# EAGLE design PS_cubesat_baterias (EAGLE 9.0.0)
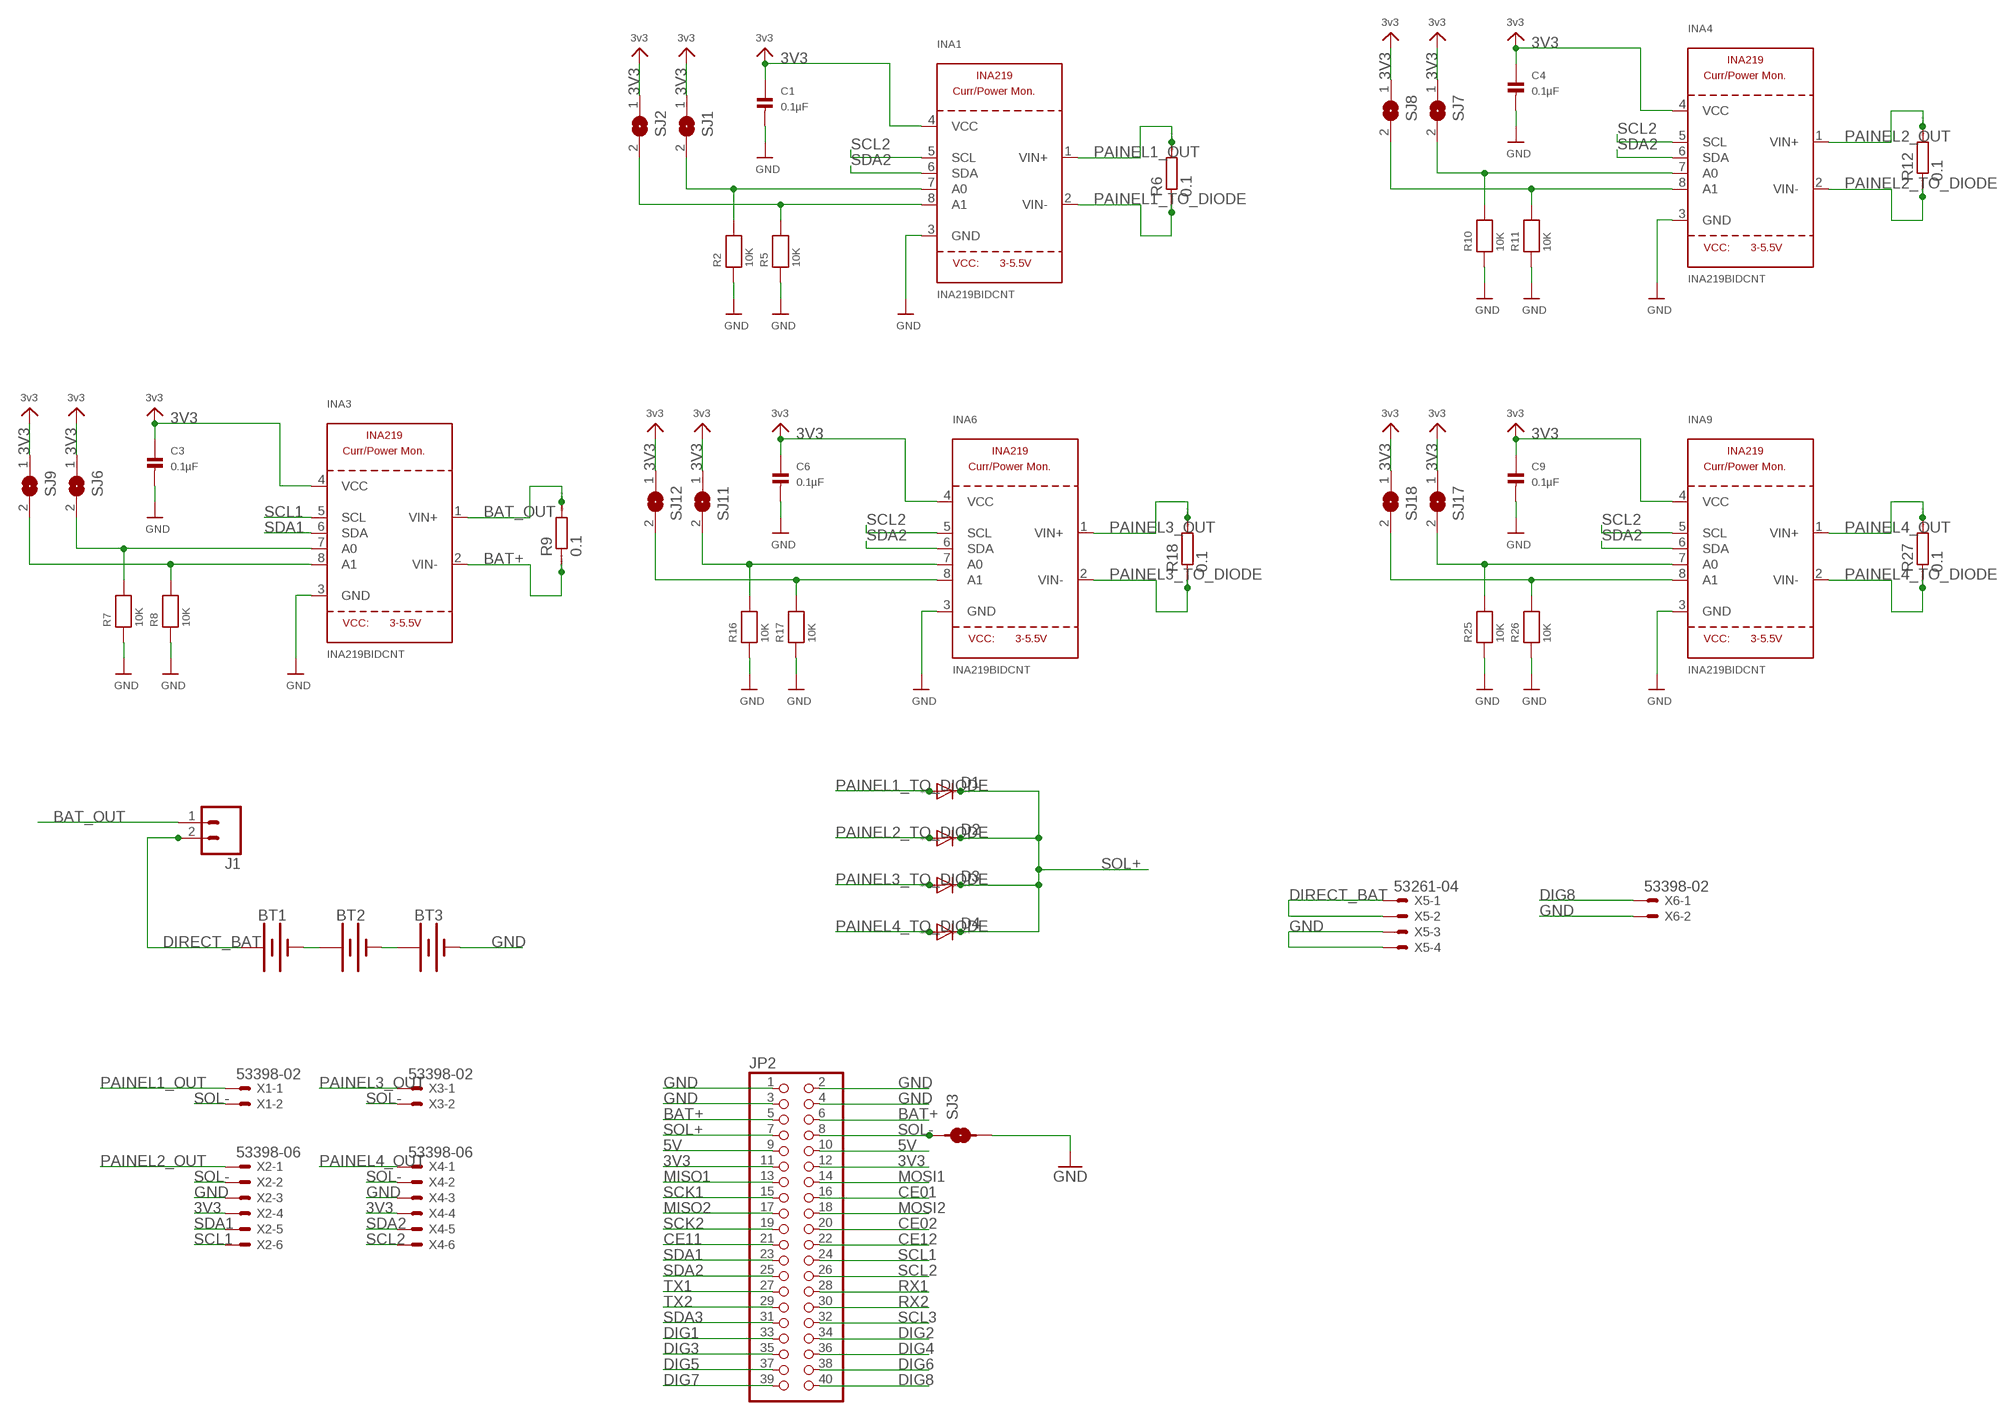
[diagram p0: schematic, sheet 1]

## Parts
BT1  BATTERY-18650  [BATTERY_18650-HOLDER]
BT2  BATTERY-18650  [BATTERY_18650-HOLDER]
BT3  BATTERY-18650  [BATTERY_18650-HOLDER]
C1  0.1µF  CAP_CERAMIC1206  [1206]
C3  0.1µF  CAP_CERAMIC1206  [1206]
C4  0.1µF  CAP_CERAMIC1206  [1206]
C6  0.1µF  CAP_CERAMIC1206  [1206]
C9  0.1µF  CAP_CERAMIC1206  [1206]
D1  DIODE-DO-214AC  [DO-214AC]
D2  DIODE-DO-214AC  [DO-214AC]
D3  DIODE-DO-214AC  [DO-214AC]
D4  DIODE-DO-214AC  [DO-214AC]
INA1  INA219BIDCNT  INA219  [SOT23-8]
INA3  INA219BIDCNT  INA219  [SOT23-8]
INA4  INA219BIDCNT  INA219  [SOT23-8]
INA6  INA219BIDCNT  INA219  [SOT23-8]
INA9  INA219BIDCNT  INA219  [SOT23-8]
J1  M02JST-PTH-VERT  [JST-2-PTH-VERT]
JP2  PINHD-2X20  [2X20]
R2  10K  RESISTOR1206  [1206]
R5  10K  RESISTOR1206  [1206]
R6  0.1  RR2512  [R2512]
R7  10K  RESISTOR1206  [1206]
R8  10K  RESISTOR1206  [1206]
R9  0.1  RR2512  [R2512]
R10  10K  RESISTOR1206  [1206]
R11  10K  RESISTOR1206  [1206]
R12  0.1  RR2512  [R2512]
R16  10K  RESISTOR1206  [1206]
R17  10K  RESISTOR1206  [1206]
R18  0.1  RR2512  [R2512]
R25  10K  RESISTOR1206  [1206]
R26  10K  RESISTOR1206  [1206]
R27  0.1  RR2512  [R2512]
SJ1  SOLDERJUMPERREFLOW_NOPASTE  [SOLDERJUMPER_REFLOW_NOPASTE]
SJ2  SOLDERJUMPERREFLOW_NOPASTE  [SOLDERJUMPER_REFLOW_NOPASTE]
SJ3  SMD-JUMPER-2  [SMD-JUMPER-2]
SJ6  SOLDERJUMPERREFLOW_NOPASTE  [SOLDERJUMPER_REFLOW_NOPASTE]
SJ7  SOLDERJUMPERREFLOW_NOPASTE  [SOLDERJUMPER_REFLOW_NOPASTE]
SJ8  SOLDERJUMPERREFLOW_NOPASTE  [SOLDERJUMPER_REFLOW_NOPASTE]
SJ9  SOLDERJUMPERREFLOW_NOPASTE  [SOLDERJUMPER_REFLOW_NOPASTE]
SJ11  SOLDERJUMPERREFLOW_NOPASTE  [SOLDERJUMPER_REFLOW_NOPASTE]
SJ12  SOLDERJUMPERREFLOW_NOPASTE  [SOLDERJUMPER_REFLOW_NOPASTE]
SJ17  SOLDERJUMPERREFLOW_NOPASTE  [SOLDERJUMPER_REFLOW_NOPASTE]
SJ18  SOLDERJUMPERREFLOW_NOPASTE  [SOLDERJUMPER_REFLOW_NOPASTE]
X1  53398-02  [53398-02]
X2  53398-06  [53398-06]
X3  53398-02  [53398-02]
X4  53398-06  [53398-06]
X5  53261-04  [53261-04]
X6  53398-02  [53398-02]

## Nets
3V3: C1.1 C3.1 C4.1 C6.1 C9.1 INA1.4(VCC) INA3.4(VCC) INA4.4(VCC) INA6.4(VCC) INA9.4(VCC) JP2.11 JP2.12 SJ1.1 SJ2.1 SJ6.1 SJ7.1 SJ8.1 SJ9.1 SJ11.1 SJ12.1 SJ17.1 SJ18.1 X2.4 X4.4 ; supply symbol labelled 3v3
5V: JP2.9 JP2.10
BAT+: INA3.2(VIN-) JP2.5 JP2.6 R9.1
BAT_OUT: INA3.1(VIN+) J1.1 R9.2
CE01: JP2.16
CE02: JP2.20
CE11: JP2.21
CE12: JP2.22
DIG1: JP2.33
DIG2: JP2.34
DIG3: JP2.35
DIG4: JP2.36
DIG5: JP2.37
DIG6: JP2.38
DIG7: JP2.39
DIG8: JP2.40 X6.1
DIRECT_BAT: BT1.PWR@1(+) J1.2 X5.1 X5.2
GND: BT3.GND@1(-) C1.2 C3.2 C4.2 C6.2 C9.2 INA1.3(GND) INA3.3(GND) INA4.3(GND) INA6.3(GND) INA9.3(GND) JP2.1 JP2.2 JP2.3 JP2.4 R2.1 R5.1 R7.1 R8.1 R10.1 R11.1 R16.1 R17.1 R25.1 R26.1 SJ3.2 X2.3 X4.3 X5.3 X5.4 X6.2
MISO1: JP2.13
MISO2: JP2.17
MOSI1: JP2.14
MOSI2: JP2.18
N$2: BT1.GND@1(-) BT2.PWR@1(+)
N$3: BT2.GND@1(-) BT3.PWR@1(+)
N$6: INA1.8(A1) R5.2 SJ2.2
N$7: INA1.7(A0) R2.2 SJ1.2
N$8: INA3.8(A1) R8.2 SJ9.2
N$9: INA3.7(A0) R7.2 SJ6.2
N$10: INA4.8(A1) R11.2 SJ8.2
N$11: INA4.7(A0) R10.2 SJ7.2
N$14: INA6.8(A1) R17.2 SJ12.2
N$15: INA6.7(A0) R16.2 SJ11.2
N$20: INA9.8(A1) R26.2 SJ18.2
N$21: INA9.7(A0) R25.2 SJ17.2
PAINEL1_OUT: INA1.1(VIN+) R6.2 X1.1
PAINEL1_TO_DIODE: D1.A INA1.2(VIN-) R6.1
PAINEL2_OUT: INA4.1(VIN+) R12.2 X2.1
PAINEL2_TO_DIODE: D2.A INA4.2(VIN-) R12.1
PAINEL3_OUT: INA6.1(VIN+) R18.2 X3.1
PAINEL3_TO_DIODE: D3.A INA6.2(VIN-) R18.1
PAINEL4_OUT: INA9.1(VIN+) R27.2 X4.1
PAINEL4_TO_DIODE: D4.A INA9.2(VIN-) R27.1
RX1: JP2.28
RX2: JP2.30
SCK1: JP2.15
SCK2: JP2.19
SCL1: INA3.5(SCL) JP2.24 X2.6
SCL2: INA1.5(SCL) INA4.5(SCL) INA6.5(SCL) INA9.5(SCL) JP2.26 X4.6
SCL3: JP2.32
SDA1: INA3.6(SDA) JP2.23 X2.5
SDA2: INA1.6(SDA) INA4.6(SDA) INA6.6(SDA) INA9.6(SDA) JP2.25 X4.5
SDA3: JP2.31
SOL+: D1.C D2.C D3.C D4.C JP2.7
SOL-: JP2.8 SJ3.1 X1.2 X2.2 X3.2 X4.2
TX1: JP2.27
TX2: JP2.29

## Library data of the parts
BT1-BT3 = SparkFun-Batteries:BATTERY: Battery - Single Cell A variety of battery chemistries, sizes, and footprints. Device List: 20MM_PTH - Coin Cell Battery Holder - 20mm (PTH) <https://www.sparkfun.com/products/783> 6.8MM_PTH - Coin Cell Battery Holder - 6.8MM(SMD) <https://www.digikey.com/product-detail/en/seiko-instruments/MS621FE-FL11E/728-1057-ND/1889208?WT.srch=1&gclid=CNOQ5a6LzdQCFZS2wAodXCkE0g> 12MM_SMD - Coin Cell Battery Holder - 12mm (SMD) <https://www.sparkfun.com/products/10592> 12MM_PTH - Coin Cell Battery Holder - 12mm (PTH) <https://www.sparkfun.com/products/7948> 20MM_SMD - 20mm Coin Cell Battery Holder (SMD) (2 legs) Used on the Big Time Watch Kit <https://www.sparkfun.com/products/11734> 20MM_SMD_4LEGS - Coin Cell Battery Holder - 20mm (SMD) <https://www.sparkfun.com/products/11892> 20MM_SMD_4LEGS_OVERPASTE - Coin Cell Battery Holder - 20mm (SMD) <https://www.sparkfun.com/products/11892> (Over-paste on the legs) 24.5MM_PTH - Coin Cell Battery Holder - 24.5mm (PTH) <https://www.sparkfun.com/products/8863> 9V - 9V Battery Holder - PC Mount Used on the SparkFun SparkPunk Sound Kit <https://www.sparkfun.com/products/11177> and SparkFun SparkPunk Sequencer Kit <https://www.sparkfun.com/products/12707> 18650 - Battery Holder - 18650 (PTH) <https://www.sparkfun.com/products/13113> AA - Battery Holder - 1xAA (PTH) <https://www.sparkfun.com/products/7949> AAA - Battery Holder - 1xAAA (PTH) <https://www.sparkfun.com/products/12718> AA_KIT - Battery Holder - 1xAA (PTH) <https://www.sparkfun.com/products/7949> Special kit package - pads only have exposed copper on one side of the board. AAA_KIT - Battery Holder - 1xAAA (PTH) <https://www.sparkfun.com/products/12718> Special kit package - pads only have exposed copper on one side of the board.; PROD_ID: BATT-12327; SF_SKU: PRT-13113
C1 C3 C4 C6 C9 = microbuilder:CAP_CERAMIC: Ceramic Capacitors 0402 - 0402 Surface Mount Capacitors 16pF 50V 5% [Digikey: 445-4899-2-ND] 18pF 50V 5% [Digikey: 490-1281-2-ND] 22pF 50V 5% [Digikey: 490-1283-2-ND] 68pF 50V 5% [Digikey: 490-1289-2-ND] 0.1uF 10V 10% [Digikey: 490-1318-2-ND] 1.0uF 6.3V 10% [Digikey: 490-1320-2-ND] 0603 - 0603 Surface Mount Capacitors 16 pF 50V 5% [Digikey: 445-5051-2-ND] 22 pF 50V [Digikey: PCC220ACVTR-ND] 33 pF 50V 5% [Digikey: 490-1415-1-ND] 56pF 50V 5% [Digikey: 490-1421-1-ND] 220pF 50V 5% [Digikey: 445-1285-1-ND] 680 pF 50V 2200 pF 50V 5% C0G [Digikey: 445-1297-1-ND] 5600 pF 100V 5% X7R [Digikey: 478-3711-1-ND] 0.1 µF 25V 10% [Digikey: PCC2277TR-ND] 0.22 µF 16V 10% X7R [Digikey: 445-1318-1-ND] 1.0 µF 25V 10% [Digikey: 445-5146-2-ND] 0603 - RF Specific 3pF 250V +/-0.1pF RF [Digikey: 712-1347-1-ND] 18 pF 250V 5% [Digikey: 478-3505-1-ND or 712-1322-1-ND] 56 pF 250V 5% C0G RF [Digikey: 490-4867-1-ND] 68 pF 250V RF [Digikey: 490-4868-1-ND] 0805 - 0805 Surface Mount Capacitors 220 pF 250V 2% RF Ceramic Capacitor [Digikey: 712-1398-1-ND] 1000 pF 50V 2% NP0 Ceramic Capacitor [Digikey: 478-3760-1-ND] 0.1 µF 25V 10% Ceramic Capacitor [Digikey: PCC1828TR-ND] 1.0 µF 16V 10% Ceramic Capacitor[Digikey: 490-1691-2-ND] 10.0 µF 10V 10% Ceramic Capacitor[Digikey: 709-1228-1-ND] 10.0 uF 16V 10% Ceramic Capacitor [Digikey: 478-5165-2-ND] 47 uF 6.3V 20% Ceramic Capacitor [Digikey: 587-1779-1-ND or 399-5506-1-ND] 1206 - 1206 Surface Mount Capacitors 47uF 10V 20% Ceramic Capacitor [Digikey: 490-5528-1-ND or 399-5508-1-ND or 445-6010-1-ND] 100uF 6.3V -20%, +80% Y5V Ceramic Capacitor (Digikey: 490-4512-1-ND, Mouser: 81-GRM31CF50J107ZE1L)
D1-D4 = diode:DIODE-: DIODE
INA1 INA3 INA4 INA6 INA9 = microbuilder:INA219: INA219 - I2C Current/Power Monitor Voltage Range: 0-26V Accuracy: 0.5% Temperature: -40°C - 125°C
J1 = SparkFun-Connectors:M02: Standard 2-pin 0.1" header. Use with - straight break away headers ( PRT-00116) - right angle break away headers (PRT-00553) - swiss pins (PRT-00743) - machine pins (PRT-00117) - female headers (PRT-00115) Molex polarized connector foot print use with: PRT-08233 with associated crimp pins and housings. 2.54_SCREWTERM for use with PRT-10571. 3.5mm Screw Terminal footprints for PRT-08084 5mm Screw Terminal footprints for use with PRT-08432
JP2 = pinhead:PINHD-2X20: PIN HEADER
R2 R5 R7 R8 R10 R11 R16 R17 R25 R26 = microbuilder:RESISTOR: Resistors 0402 - 0402 Surface Mount Package 22 Ohm 1% 1/16W [Digikey: 311-22.0LRTR-ND] 33 Ohm 5% 1/16W 1.0K 5% 1/16W 1.5K 5% 1/16W 2.0K 1% 1/16W 10.0K 1% 1/16W [Digikey: 311-10.0KLRTR-ND] 10.0K 5% 1/16W [Digikey: RMCF0402JT10K0TR-ND] 12.1K 1% 1/16W [Digikey: 311-22.0LRTR-ND] 100.0K 5% 1/16W 0603 - 0603 Surface Mount Package 0 Ohm 1/10 Watt 1% Resistor 15 Ohm 1/10 Watt 1% Resistor 33 Ohm 1/10 Watt 1% Resistor 49.9 Ohm 1/10 Watt 1% Resistor 100 Ohm 1/10 Watt 1% Resistor 150 Ohm 1/10 Watt 1% Resistor 240 Ohm 1/10 Watt 1% Resistor 390 Ohm 1/10 Watt 1% Resistor 560 Ohm 1/10 Watt 1% Resistor 680 Ohm 1/10 Watt 1% Resistor 750 Ohm 1/10 Watt 1% Resistor 1.0K Ohm 1/10 Watt 1% Resistor 1.5K Ohm 1/10 Watt 1% Resistor 2.0K Ohm 1/10 Watt 1% Resistor 2.2K Ohm 1/10 Watt 1% Resistor 3.3K Ohm 1/10 Watt 1% Resistor 4.7K Ohm 1/10 Watt 1% Resistor 10.0K Ohm 1/10 Watt 1% Resistor 12.0K Ohm 1/10 Watt 1% Resistor 12.1K Ohm 1/10 Watt 1% Resistor 20.0K Ohm 1/10 Watt 1% Resistor 33.0K Ohm 1/10 Watt 1% Resistor 100.0K Ohm 1/10 Watt 1% Resistor 0805 - 0805 Surface Mount Package 0 Ohm 1/8 Watt 1% Resistor 33 Ohm 1/8 Watt 1% Resistor 100 Ohm 1/8 Watt 1% Resistor 150 Ohm 1/8 Watt 1% Resistor 200 Ohm 1/8 Watt 1% Resistor 240 Ohm 1/8 Watt 1% Resistor 330 Ohm 1/8 Watt 1% Resistor 390 Ohm 1/8 Watt 1% Resistor 470 Ohm 1/8 Watt 1% Resistor 1.0K Ohm 1/8 Watt 1% Resistor 1.5K Ohm 1/8 Watt 1% Resistor 2.0K Ohm 1/8 Watt 1% Resistor 4.7K Ohm 1/8 Watt 1% Resistor 5.1K Ohm 1/8 Watt 1% Resistor 5.6K Ohm 1/8 Watt 1% Resistor 10.0K Ohm 1/8 Watt 1% Resistor 22.0K Ohm 1/8 Watt 1% Resistor 33.0K Ohm 1/8 Watt 1% Resistor 100K Ohm 1/8 Watt 1% Resistor 1206 - 1206 Surface Mount Package 2012 - 2010 Surface Mount Package 0.11 Ohm 1/2 Watt 1% Resistor - Digikey: RHM.11UCT-ND
R6 R9 R12 R18 R27 = eagle-ltspice:R: RESISTOR, European symbol; SPICEMODEL: NONE; SPICEPREFIX: R
SJ1 SJ2 SJ6-SJ9 SJ11 SJ12 SJ17 SJ18 = microbuilder:SOLDERJUMPER: SMD Solder JUMPER Solder the two pads together to create a connection, or remove the solder to break it. REFLOW - Use this footprint for solder paste and reflow ovens. WAVE - Use this footprint for hand-soldering (larger pads). CLOSED - Has a trace between the two pads to ensure it is closed by default. The trace needs to be cut to disable the jumper, and can be closed again by creating a solder bridge between the two pads.
SJ3 = FaBo-etc:SMD-JUMPER-2
X1 X3 X6 = con-molex:53?-02: CONNECTOR wire to board 1.25 mm (.049 inch) pitch header; MF: MOLEX; OC_FARNELL: unknown; OC_NEWARK: unknown
X2 X4 = con-molex:53?-06: CONNECTOR wire to board 1.25 mm (.049 inch) pitch header; MF: MOLEX; OC_FARNELL: 1125368; OC_NEWARK: unknown
X5 = con-molex:53?-04: CONNECTOR wire to board 1.25 mm (.049 inch) pitch header; MF: MOLEX; OC_FARNELL: 1125374; OC_NEWARK: unknown

## Board
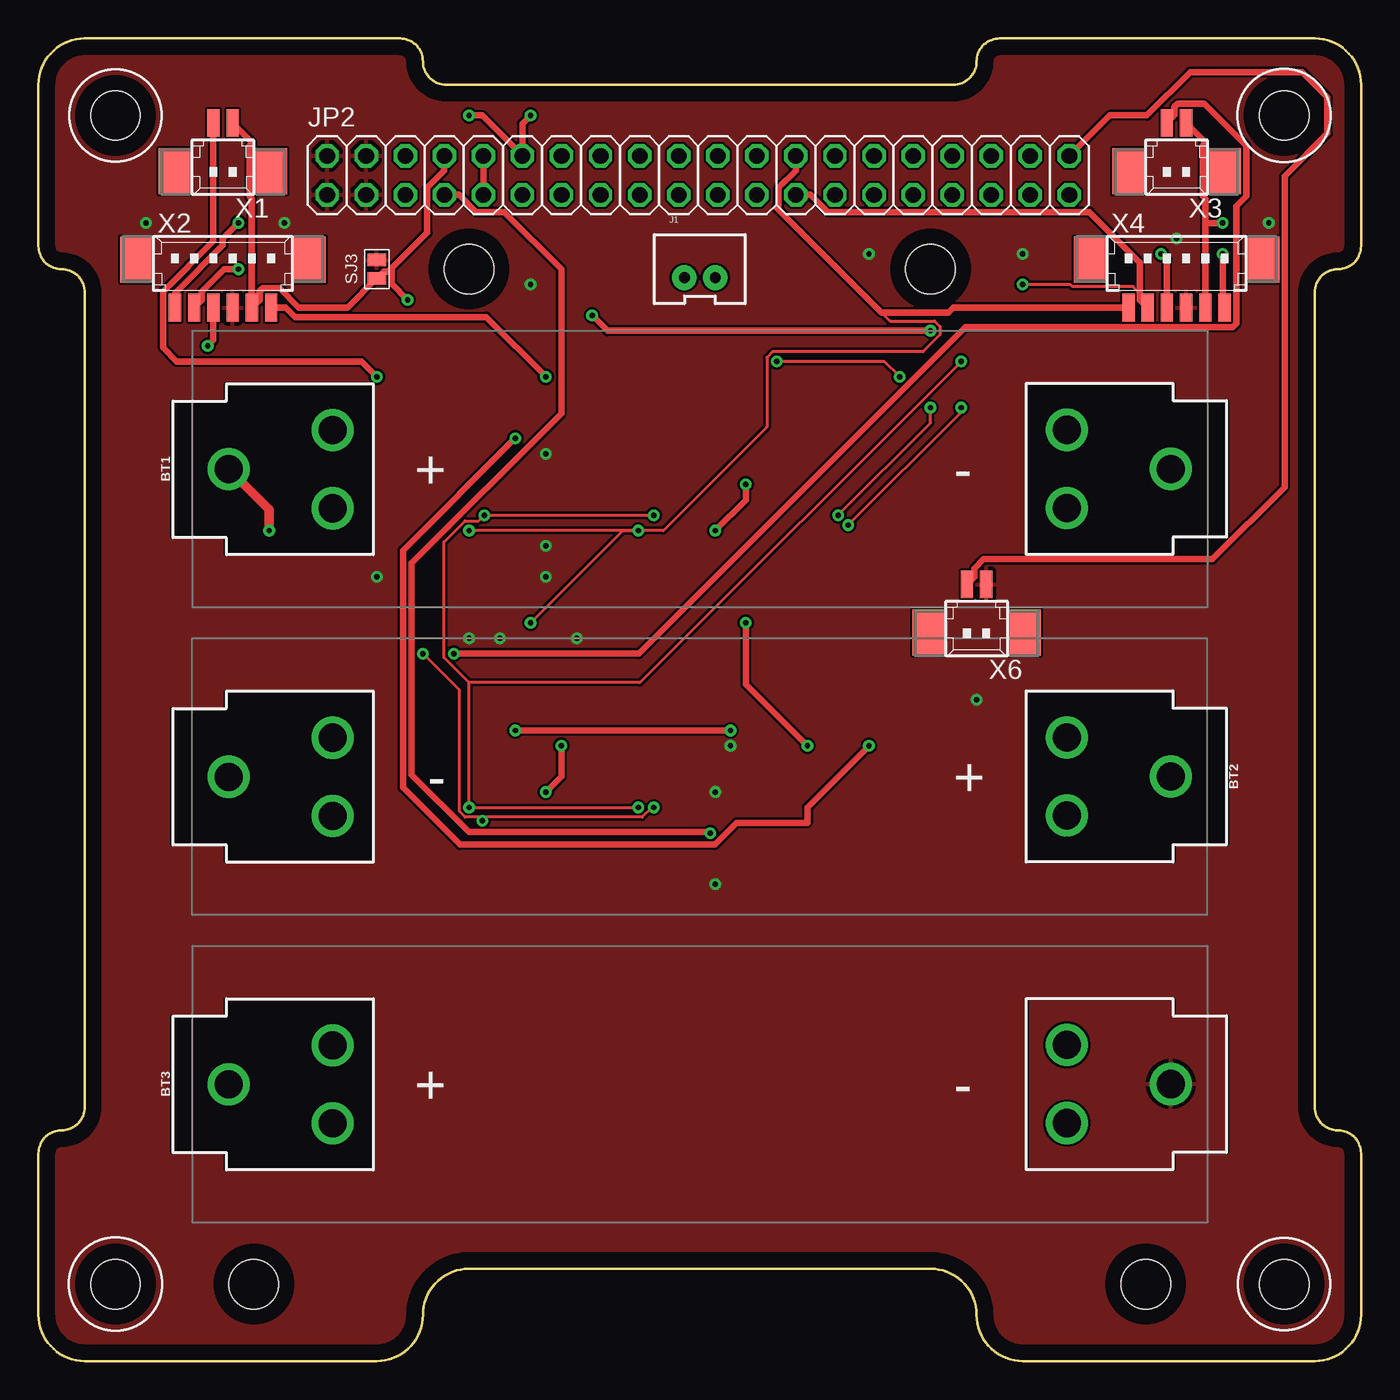
[diagram p1: board, top side]
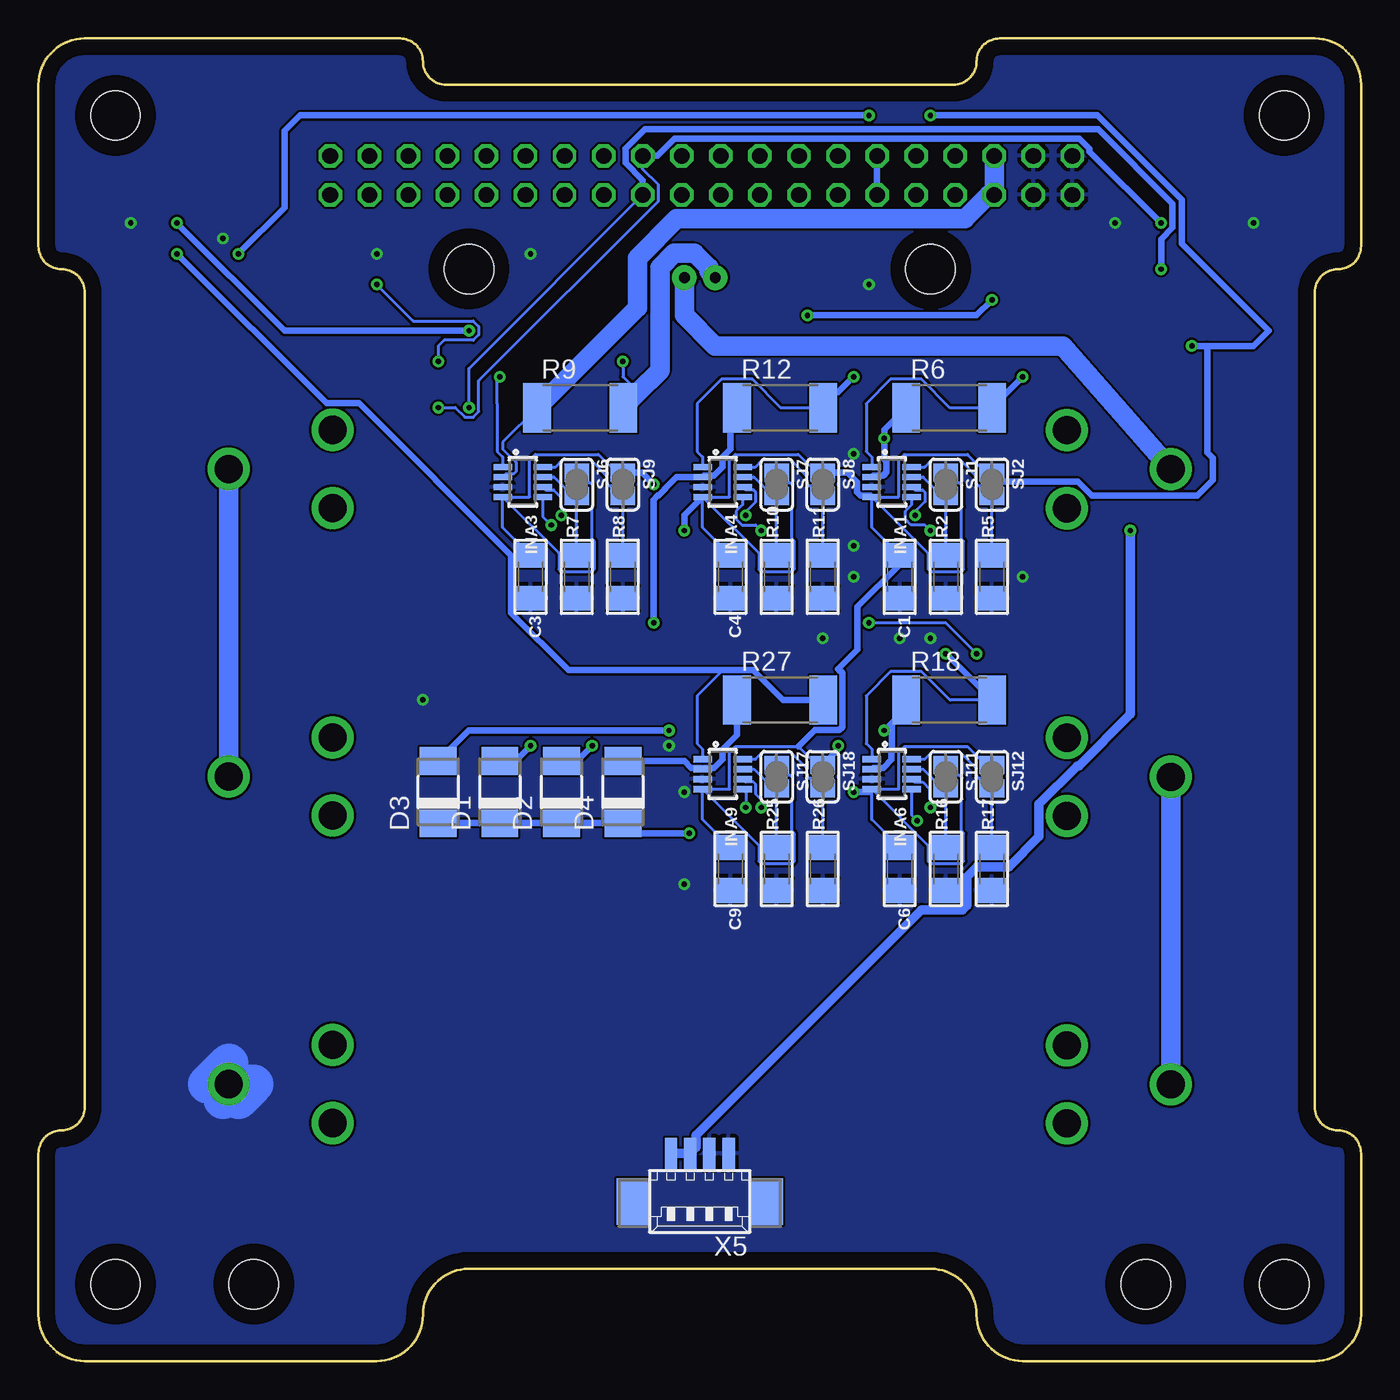
[diagram p2: board, bottom side, seen from below]

Size 86 x 86 mm. Coordinates in mm from the lower left corner, seen from the top.
Outline: 0,83 0,72.5 arc90 1.5,71 arc-90 3,69.5 3,16.5 arc-90 1.5,15 arc90 0,13.5 0,3 arc90 3,0 22,0 arc90 25,3 arc-90 28,6 58,6 arc-90 61,3 arc90 64,0 83,0 arc90 86,3 86,13.5 arc90 84.5,15 arc-90 83,16.5 83,69.5 arc-90 84.5,71 arc90 86,72.5 86,83 arc90 83,86 62.5,86 arc90 61,84.5 arc-90 59.5,83 26.5,83 arc-90 25,84.5 arc90 23.5,86 3,86 arc90 0,83
Copper layers (1*16): Top 0.035mm / dielectric 1.5mm / Bottom 0.035mm
Design rules "default *": minimum track width 6mil, minimum drill 0.35mm, track to track 6mil, track to pad 6mil, pad to pad 6mil, via to via 6mil, smd to smd 6mil, copper to edge 40mil, drill to drill 6mil, minimum pad ring 10mil, minimum via ring 8mil, stop-mask expansion 4mil, vias tented up to drill 30mil, thermal gap 10mil
Holes 3.2 mm at 5,5 81,5 81,81 5,81 14,5 72,5 28,71 58,71

### Footprints (pad centres in the part's own frame; a part is rotated, then mirrored left to right if it is on the bottom)
BATTERY_18650-HOLDER = drill 1.829: GND@1 30.628,0.01; GND@2 23.88,2.55; GND@3 23.88,-2.53; PWR@1 -30.628,-0.01; PWR@2 -23.88,2.53; PWR@3 -23.88,-2.55
1206 = smd 1.6 x 1.8: 1 -1.4,0; 2 1.4,0
DO-214AC = smd 1.8 x 2.4: A 2.025,0; C -2.025,0
SOT23-8 = smd 0.4 x 1.2: 1 -0.975,-1.3; 2 -0.325,-1.3; 3 0.325,-1.3; 4 0.975,-1.3; 5 0.975,1.3; 6 0.325,1.3; 7 -0.325,1.3; 8 -0.975,1.3
JST-2-PTH-VERT = drill 0.7 pad 1.6: 1 -1,-0.55; 2 1,-0.55
2X20 = drill 1.016 octagon: 1 -24.13,-1.27; 2 -24.13,1.27; 3 -21.59,-1.27; 4 -21.59,1.27; 5 -19.05,-1.27; 6 -19.05,1.27; 7 -16.51,-1.27; 8 -16.51,1.27; 9 -13.97,-1.27; 10 -13.97,1.27; 11 -11.43,-1.27; 12 -11.43,1.27; 13 -8.89,-1.27; 14 -8.89,1.27; 15 -6.35,-1.27; 16 -6.35,1.27; 17 -3.81,-1.27; 18 -3.81,1.27; 19 -1.27,-1.27; 20 -1.27,1.27; 21 1.27,-1.27; 22 1.27,1.27; 23 3.81,-1.27; 24 3.81,1.27; 25 6.35,-1.27; 26 6.35,1.27; 27 8.89,-1.27; 28 8.89,1.27; 29 11.43,-1.27; 30 11.43,1.27; 31 13.97,-1.27; 32 13.97,1.27; 33 16.51,-1.27; 34 16.51,1.27; 35 19.05,-1.27; 36 19.05,1.27; 37 21.59,-1.27; 38 21.59,1.27; 39 24.13,-1.27; 40 24.13,1.27
R2512 = smd 1.8 x 3.2: 1 -2.8,0; 2 2.8,0
SOLDERJUMPER_REFLOW_NOPASTE = smd 1.168 x 1.6: 1 -0.762,0; 2 0.762,0
SMD-JUMPER-2 = smd 0.8 x 1.2: 1 -0.6,0; 2 0.6,0
53398-02 = smd 0.8 x 1.8: 1 0.625,-2.5; 2 -0.625,-2.5 | smd 2.1 x 3: S1 3.125,0.625; S2 -3.125,0.625
53398-06 = smd 0.8 x 1.8: 1 3.125,-2.5; 2 1.875,-2.5; 3 0.625,-2.5; 4 -0.625,-2.5; 5 -1.875,-2.5; 6 -3.125,-2.5 | smd 2.1 x 3: S1 5.625,0.625; S2 -5.625,0.625
53261-04 = smd 0.8 x 2: 1 1.875,-2.5; 2 0.625,-2.5; 3 -0.625,-2.5; 4 -1.875,-2.5 | smd 2.1 x 3: S1 4.375,0.625; S2 -4.375,0.625

### Placement (x,y rotation side)
BT1  43,58 0 top
BT2  43,38 180 top
BT3  43,18 0 top
C1  30,51 270 bottom
C3  54,51 270 bottom
C4  41,51 270 bottom
C6  30,32 270 bottom
C9  41,32 270 bottom
D1  56,37 90 bottom
D2  52,37 90 bottom
D3  60,37 90 bottom
D4  48,37 90 bottom
INA1  30.51,57.16 270 bottom
INA3  54.51,57.16 270 bottom
INA4  41.51,57.16 270 bottom
INA6  30.51,38.16 270 bottom
INA9  41.51,38.16 270 bottom
J1  43,71 0 top
JP2  42.9,77.1 0 top
R2  27,51 90 bottom
R5  24,51 90 bottom
R6  26.78,61.98 0 bottom
R7  51,51 90 bottom
R8  48,51 90 bottom
R9  50.78,61.98 0 bottom
R10  38,51 90 bottom
R11  35,51 90 bottom
R12  37.78,61.98 0 bottom
R16  27,32 90 bottom
R17  24,32 90 bottom
R18  26.78,42.98 0 bottom
R25  38,32 90 bottom
R26  35,32 90 bottom
R27  37.78,42.98 0 bottom
SJ1  27,57 270 bottom
SJ2  24,57 270 bottom
SJ3  22,71 90 top
SJ6  51,57 270 bottom
SJ7  38,57 270 bottom
SJ8  35,57 270 bottom
SJ9  48,57 270 bottom
SJ11  27,38 270 bottom
SJ12  24,38 270 bottom
SJ17  38,38 270 bottom
SJ18  35,38 270 bottom
X1  12,78 180 top
X2  12,71 0 top
X3  74,78 180 top
X4  74,71 0 top
X5  43,11 180 bottom
X6  61,48 180 top

### Tracks (layer width: path | path; a pad name or v marks a point on that pad's centre or on a via)
3V3  (via drill 0.35)
  Top 0.406: X2.4 11.38,66.38 v11,66 | v28,81 28.84,81 JP2.12 31.47,80.47 v32,81 | X4.4 73.38,71.62 v73,72 | v44,54 46,56 v46,57 | v33,37 34,38 v34,40
  Bottom 0.203: C1.1 31.81,54.21 INA1.4 | INA1.4 30.06,56.19 30.06,58.59 29.7,58.96 25.59,58.96 24.2,57.56 SJ2.1 | INA1.4 28.15,52.53 28.15,51.49 28,51.35 26,51.35 25.85,51.49 25.85,53.3 26,53.46 26,55.49 25.95,55.55 25.95,56.93 26.09,57.08 26.31,57.08 SJ1.1 | C4.1 42.81,54.21 INA4.4 | INA4.4 41.06,56.19 41.06,58.59 40.7,58.96 36.59,58.96 35.2,57.56 SJ8.1 | INA4.4 39.15,52.53 39.15,51.49 39.01,51.35 36.99,51.35 36.85,51.49 36.85,53.3 37,53.46 37,55.49 36.95,55.55 36.95,56.93 37.09,57.08 37.31,57.08 SJ7.1 | C6.1 31.81,35.21 INA6.4 | INA6.4 30.06,37.19 30.06,39.59 29.7,39.96 25.59,39.96 24.2,38.56 SJ12.1 | INA6.4 28.15,33.53 28.15,32.49 28,32.35 26,32.35 25.85,32.49 25.85,34.3 26,34.46 26,36.49 25.95,36.55 25.95,37.93 26.09,38.08 26.31,38.08 SJ11.1 | C9.1 42.81,35.21 INA9.4 | INA9.4 41.06,37.19 41.06,39.59 40.7,39.96 36.59,39.96 35.2,38.56 SJ18.1 | INA9.4 39.15,33.53 39.15,32.49 39.01,32.35 36.99,32.35 36.85,32.49 36.85,34.3 37,34.46 37,36.49 36.95,36.55 36.95,37.93 37.09,38.08 37.31,38.08 SJ17.1 | C3.1 55.81,54.21 INA3.4 | INA3.4 54.06,56.19 54.06,58.59 53.7,58.96 49.59,58.96 48.2,57.56 SJ9.1 | INA3.4 52.15,52.53 52.15,51.49 52.01,51.35 49.99,51.35 49.85,51.49 49.85,53.3 50,53.46 50,55.49 49.95,55.55 49.95,56.93 50.09,57.08 50.31,57.08 SJ6.1
  Bottom 0.406: JP2.12 JP2.11 | v11,66 10,66 | 10,66 7,66 6,67 11.66,72.66 11.66,75.52 17.14,81 v28,81 | v73,72 70,75 70,80 69,81 v32,81 | 10,66 10,59.06 9.64,58.7 9.64,57.27 10.66,56.26 17.49,56.26 18.41,57.18 23.42,57.18 SJ2.1 | SJ8.1 33.39,57.76 32.77,57.14 32.77,56.49 32.56,56.28 31.9,56.28 INA1.4 | INA4.4 44,54.99 v44,54 | v46,57 46.76,57.76 SJ9.1 | INA6.4 32,37 v33,37 | v34,40 34,39.76 SJ18.1 | 36.59,39.96 35.52,41.02 33.93,41.02 33.72,41.23 33.72,44.73 33.93,44.94 33.94,44.94 34,45 32.73,46.27 32.73,49.07 30,51.8 C1.1
5V
  Top 0.406: JP2.9 JP2.10
BAT+
  Bottom 0.203: R9.1 55.81,59.75 55.81,59.29 54.96,58.44 54.96,57.83 55.1,57.68 55.61,57.68 INA3.2
  Bottom 1.27: R9.1 47.06,68.5 47.06,71.72 44.5,74.28 25.75,74.28 24.2,75.83 JP2.5 JP2.6
BAT_OUT  (via drill 0.35)
  Top 0.203: v56,64 55,65 v48,65
  Bottom 0.203: INA3.1 55.81,58.79 56.17,59.15 56.17,62 56.17,62.25 56.17,63.83 v56,64 | v48,65 48,64 47,63
  Bottom 1.27: J1.1 42.41,70.86 42.41,71.11 43.34,72.04 44.66,72.04 45.59,71.11 45.59,64.41 47,63 48,62 R9.2
DIG8
  Top 0.406: X6.1 60.87,50.99 60.87,51.55 61.45,52.13 76.33,52.13 81.03,56.83 81.03,77.04 83.82,79.83 83.82,82.17 82.17,83.82 74.89,83.82 72.07,81 69.66,81 JP2.40
DIRECT_BAT  (via drill 0.35)
  Top 0.61: v15,54 15,55.36 BT1.PWR@1
  Bottom 0.61: X5.1 X5.2 43.23,13.89 43.23,14.69 28.58,29.34 25.91,29.34 25.64,29.61 25.64,31.48 24.98,32.14 22.91,32.14 20.95,34.1 20.95,36.21 18.45,38.7 18.36,38.7 15,42.06 v15,54
  Bottom 1.27: BT1.PWR@1 19.38,66 42,66 44,68 J1.2
GND  (via drill 0.35)
  Bottom 2.54: BT3.GND@1 73.63,19.37 75,18 74,18 73,17 72,18 73,18 74,17
  other vias: 33,59 33,53 33,51 22,51 16,74 7,74 32,70 54,72 64,72 74,73 80,74 61,43 44,31 45,40 44,37 30,47 28,47 35,47
  pour Top: 64,0 83,0 arc90 86,3 86,13.5 arc90 84.5,15 arc-90 83,16.5 83,69.5 arc-90 84.5,71 arc90 86,72.5 86,83 arc90 83,86 62.5,86 arc90 61,84.5 arc-90 59.5,83 26.5,83 arc-90 25,84.5 arc90 23.5,86 3,86 arc90 0,83 0,72.5 arc90 1.5,71 arc-90 3,69.5 3,16.5 arc-90 1.5,15 arc90 0,13.5 0,3 arc90 3,0 22,0 arc90 25,3 arc-90 28,6 58,6 arc-90 61,3 arc90
  pour Bottom: 64,0 83,0 arc90 86,3 86,13.5 arc90 84.5,15 arc-90 83,16.5 83,69.5 arc-90 84.5,71 arc90 86,72.5 86,83 arc90 83,86 62.5,86 arc90 61,84.5 arc-90 59.5,83 26.5,83 arc-90 25,84.5 arc90 23.5,86 3,86 arc90 0,83 0,72.5 arc90 1.5,71 arc-90 3,69.5 3,16.5 arc-90 1.5,15 arc90 0,13.5 0,3 arc90 3,0 22,0 arc90 25,3 arc-90 28,6 58,6 arc-90 61,3 arc90
N$2
  Bottom 1.27: BT1.GND@1 BT2.PWR@1
N$3
  Bottom 1.27: BT2.GND@1 BT3.PWR@1
N$6
  Bottom 0.203: INA1.8 28.37,58.13 27.91,58.6 26.09,58.6 25.05,57.56 25.05,57.07 24.91,56.92 24.42,56.92 24,56.51 SJ2.2 R5.2
N$7
  Bottom 0.203: R2.2 27,56 | 27,56 SJ1.2 | INA1.7 28.48,57.48 27,56
N$8
  Bottom 0.203: INA3.8 52.37,58.13 51.91,58.6 50.09,58.6 49.05,57.56 49.05,57.07 48.91,56.92 48.42,56.92 48,56.51 SJ9.2 R8.2
N$9
  Bottom 0.203: R7.2 51,56 | 51,56 SJ6.2 | INA3.7 52.48,57.48 51,56
N$10
  Bottom 0.203: INA4.8 39.37,58.13 38.91,58.6 37.09,58.6 36.05,57.56 36.05,57.07 35.91,56.92 35.42,56.92 35,56.51 SJ8.2 R11.2
N$11
  Bottom 0.203: R10.2 38,56 | 38,56 SJ7.2 | INA4.7 39.48,57.48 38,56
N$14
  Bottom 0.203: INA6.8 28.37,39.13 27.91,39.6 26.09,39.6 25.05,38.56 25.05,38.07 24.91,37.92 24.42,37.92 24,37.51 SJ12.2 R17.2
N$15
  Bottom 0.203: R16.2 27,37 | 27,37 SJ11.2 | INA6.7 28.48,38.48 27,37
N$20
  Bottom 0.203: INA9.8 39.37,39.13 38.91,39.6 37.09,39.6 36.05,38.56 36.05,38.07 35.91,37.92 35.42,37.92 35,37.51 SJ18.2 R26.2
N$21
  Bottom 0.203: R25.2 38,37 | 38,37 SJ17.2 | INA9.7 39.48,38.48 38,37
PAINEL1_OUT  (via drill 0.35)
  Top 0.406: X1.1 11.38,72.8 8.12,69.55 8.12,65.88 9,65 21,65 v22,64
  Bottom 0.203: INA1.1 31.81,58.79 32.17,59.15 32.17,62.25 30.59,63.83 28.57,63.83 26.72,61.98 24,61.98 R6.2
  Bottom 0.406: v22,64 24,62 24,61.98
PAINEL1_TO_DIODE  (via drill 0.35)
  Top 0.406: v54,40 50,36 50,35 45.39,35 43.98,33.59 27.41,33.59 23.71,37.29 23.71,52.71 v31,60
  Bottom 0.406: D1.A 54.98,39.02 v54,40 | R6.1 31,60.56 v31,60 31,58.63 30.85,58.48 30.85,57.79 31.06,57.58 31.72,57.58 INA1.2
PAINEL2_OUT  (via drill 0.35)
  Top 0.406: X2.1 16.07,68.5 16.68,67.89 29.11,67.89 v33,64
  Bottom 0.203: INA4.1 42.81,58.79 43.17,59.15 43.17,62.25 41.59,63.83 39.58,63.83 37.72,61.98 35,61.98 R12.2
  Bottom 0.406: v33,64 34,63 35,63 35,61.98
PAINEL2_TO_DIODE  (via drill 0.35)
  Top 0.406: v50,40 46,44 v46,48
  Bottom 0.406: D2.A 50.98,39.02 v50,40 | R12.1 41,61.56 41,59.3 41.52,58.78 41.52,58.12 42.06,57.58 42.72,57.58 INA4.2 43,57.48 43.52,57.48 44.52,57.48 45.27,56.73 45.27,56.7 45.7,56.27 45.73,56.27 46,56 v46,48
PAINEL3_OUT  (via drill 0.35)
  Top 0.406: v27,46 39.04,46 60.28,67.24 77.67,67.24 77.88,67.45 77.88,75.08 78.53,75.73 78.53,79.02 75.8,81.76 74.08,81.76 73.87,81.55 73.87,80.99 X3.1
  Bottom 0.203: INA6.1 31.81,39.79 32.17,40.15 32.17,43.25 30.59,44.83 28.57,44.83 26.72,42.98 R18.2
  Bottom 0.406: v27,46 R18.2
PAINEL3_TO_DIODE  (via drill 0.35)
  Top 0.406: v45,41 v31,41
  Bottom 0.406: D3.A 58.02,41 v45,41 | v31,41 30.5,41.5 | 30.5,41.5 29.58,42.42 R18.1 | INA6.2 31.72,38.58 31.06,38.58 30.52,39.12 30.52,39.78 30.5,39.8 30.5,41.5
PAINEL4_OUT  (via drill 0.35)
  Top 0.406: X4.1 77,68.62 v77,72
  Bottom 0.203: INA9.1 42.81,39.79 43.17,40.15 43.17,43.25 41.59,44.83 39.58,44.83 37.72,42.98 36,42.98 R27.2
  Bottom 0.406: v77,72 67.28,62.28 65.17,62.28 55.26,52.37 55.26,48.65 51.54,44.94 39.53,44.94 37.58,42.98 36,42.98
PAINEL4_TO_DIODE
  Bottom 0.406: D4.A 44,39.02 43.56,38.58 42.9,38.58 INA9.2 42.72,38.58 42.06,38.58 41.52,39.12 41.52,39.78 40.89,40.41 40.88,40.41 40.58,40.72 R27.1
SCL1  (via drill 0.35)
  Top 0.203: v52.64,54.36 60,61.72 v60,62
  Top 0.406: X2.6 8.88,69.44 11.98,72.55 11.98,72.98 v13,74
  Bottom 0.203: INA3.5 53.21,54.92 v52.64,54.36 | JP2.24 46.71,77.51 45.69,76.49 45.69,75.41 57.37,63.73 57.37,61.74 57.74,61.37 58.26,61.37 58.89,62 v60,62
  Bottom 0.406: JP2.24 45.75,78.37 44.63,79.49 18.31,79.49 17.65,78.83 17.65,78.65 v13,74
SCL2  (via drill 0.35)
  Top 0.203: v39,54 v28,54 | v40,36 39.89,36 39.26,35.37 29.1,35.37 v28.86,35.13 28.63,35.37 27.74,35.37 27.37,35.74 27.37,43.63 v25,46 | v32,48 38,54 v39,54 | v39,54 40.64,54 47.37,60.73 47.37,65.26 47.74,65.63 57.53,65.63 58.63,66.74 58.63,67.26 58.26,67.63 55.37,67.63 54.82,68.18
  Top 0.406: X4.6 59.49,68.5 59.17,68.18 54.82,68.18 48,75 48.13,75.13 48.13,76.29 49.25,77.41 JP2.26
  Bottom 0.203: INA4.5 40.21,55.68 40.63,55.26 40.63,54.74 40.26,54.37 39.37,54.37 v39,54 | v28,54 28.37,54.37 29.26,54.37 29.63,54.74 29.63,55.26 29.21,55.68 INA1.5 | INA9.5 40,36.98 v40,36 | v28.86,35.13 29.21,35.48 INA6.5 | v25,46 27,48 v32,48
SDA1  (via drill 0.35)
  Top 0.203: v52,55 58,61 v58,62
  Top 0.406: X2.5 10.62,68.99 10.62,69.55 12.07,71 | 12.07,71 v13,71 | 12.07,71
  Bottom 0.203: INA3.6 53.01,56.64 52.51,56.64 52.05,56.19 52.05,55.55 52,55.49 v52,55 | v58,62 58,64.54 JP2.23
  Bottom 0.406: v13,71 13,72.96 12.27,73.7 12.27,75.27 17.1,80.1 46.56,80.1 47.83,78.83 47.83,77.91 46.71,76.79 JP2.23
SDA2  (via drill 0.35)
  Top 0.203: v40,55 v29,55 28.63,54.63 27.74,54.63 26.37,53.26 26.37,45.74 28,44.11 | v39,36 v28,36 28,44.11 | X4.5 71.53,69.1 71.53,69.5 71.16,69.87 67.22,69.87 67.09,70 v64,70 | v60,65 39.11,44.11 28,44.11
  Top 0.406: X4.5 71.63,68.99 71.63,71.42 68.34,74.71 51.33,74.71 50.21,75.83 JP2.25
  Bottom 0.203: INA1.6 29.01,56.64 28.5,56.64 28.36,56.49 28.36,55.88 29,55.24 v29,55 | INA4.6 40.01,56.64 39.51,56.64 39.36,56.49 39.36,55.88 40,55.24 v40,55 | INA6.6 29.01,37.64 28.5,37.64 28.05,37.19 28.05,36.55 28,36.49 v28,36 | v39,36 39,36.49 39.36,36.85 39.36,37.49 39.51,37.64 40.01,37.64 INA9.6 | v60,65 60,66 59.63,66.37 57.74,66.37 57.37,66.74 57.37,67.26 57.74,67.63 61.63,67.63 v64,70
SOL+  (via drill 0.35)
  Top 0.406: JP2.7 27.35,75.83 28.47,74.71 30.29,74.71 34,71 34,61.61 24.27,51.88 24.27,38.12 27.99,34.4 43.6,34.4 v43.68,34.32
  Bottom 0.406: v43.68,34.32 47.35,34.32 D4.C D2.C D1.C D3.C
SOL-  (via drill 0.35)
  Top 0.406: X1.2 13.88,79.25 13.88,79.18 13.72,79.02 13.72,75.73 13.88,75.57 X2.2 14.37,68.99 14.37,69.55 14.58,69.76 15.67,69.76 16.93,68.5 20.1,68.5 SJ3.1 22.44,70.84 22.75,70.84 22.95,71.05 | JP2.8 26.39,77.41 25.27,76.29 25.27,73.37 22.95,71.05 | X3.2 75.88,79.25 75.88,79.18 75.72,79.02 75.72,75.73 75.88,75.57 75.88,74 | 75.88,74 X4.2 | 75.88,74 v77,74 | v58,67 37,67 v36,68 | v24,69 22.95,70.05 22.95,71.05
  Bottom 0.406: v77,74 70,67 v58,67 | v36,68 25,68 v24,69